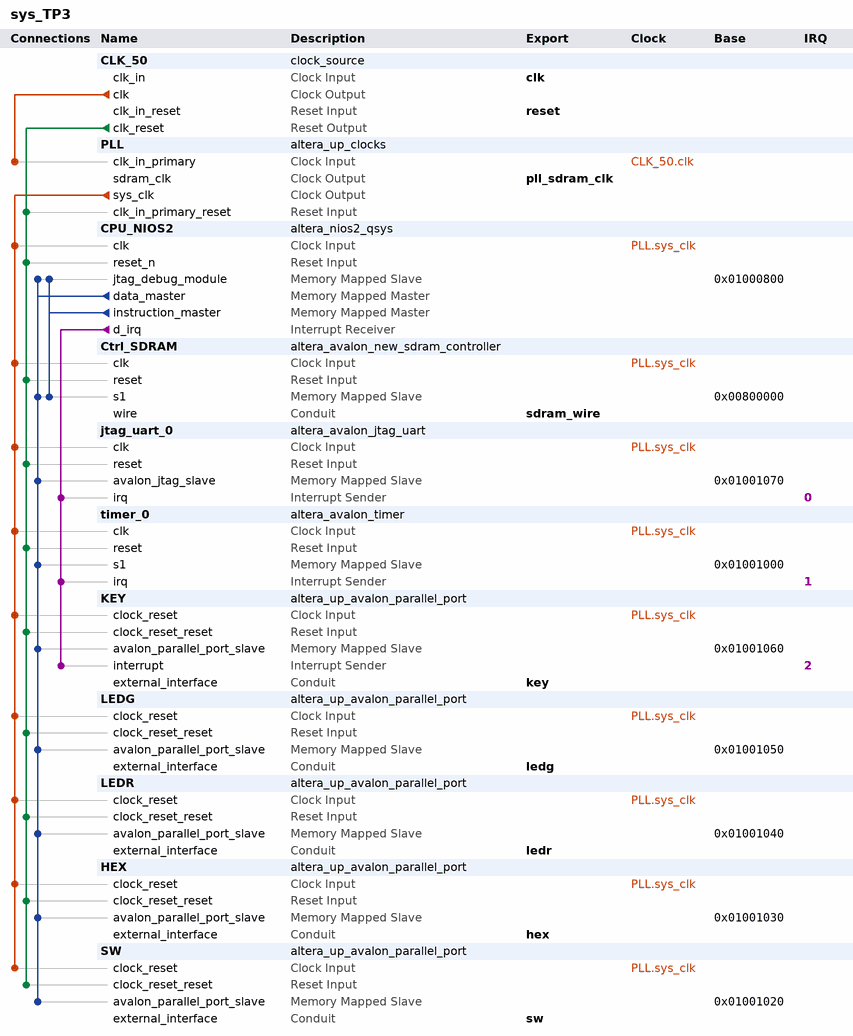
[diagram p0: system contents]
# Platform Designer (Qsys) system sys_TP3, Cyclone II EP2C20F484C7
# Parameters at their usual value, and those the tool derives, are not listed.
package require -exact qsys 13.0
create_system sys_TP3
set_project_property DEVICE_FAMILY {Cyclone II}
set_project_property DEVICE EP2C20F484C7

add_instance CLK_50 clock_source 13.0
set_instance_parameter_value CLK_50 clockFrequency 50000000

add_instance PLL altera_up_clocks 13.0
set_instance_parameter_value PLL board DE1
set_instance_parameter_value PLL vga_clk false
set_instance_parameter_value PLL audio_clk false
set_instance_parameter_value PLL audio_clk_freq 12.288

add_instance CPU_NIOS2 altera_nios2_qsys 13.0
set_instance_parameter_value CPU_NIOS2 resetSlave Ctrl_SDRAM.s1
set_instance_parameter_value CPU_NIOS2 mmu_TLBMissExcSlave None
set_instance_parameter_value CPU_NIOS2 exceptionSlave Ctrl_SDRAM.s1
set_instance_parameter_value CPU_NIOS2 breakSlave CPU_NIOS2.jtag_debug_module
set_instance_parameter_value CPU_NIOS2 impl Tiny
set_instance_parameter_value CPU_NIOS2 icache_size 4096

add_instance Ctrl_SDRAM altera_avalon_new_sdram_controller 13.0.1.99.2
set_instance_parameter_value Ctrl_SDRAM TAC 5.5
set_instance_parameter_value Ctrl_SDRAM TRCD 20.0
set_instance_parameter_value Ctrl_SDRAM TRP 20.0
set_instance_parameter_value Ctrl_SDRAM casLatency 3
set_instance_parameter_value Ctrl_SDRAM columnWidth 8
set_instance_parameter_value Ctrl_SDRAM dataWidth 16
set_instance_parameter_value Ctrl_SDRAM generateSimulationModel false
set_instance_parameter_value Ctrl_SDRAM model single_Micron_MT48LC4M32B2_7_chip
set_instance_parameter_value Ctrl_SDRAM numberOfBanks 4
set_instance_parameter_value Ctrl_SDRAM numberOfChipSelects 1
set_instance_parameter_value Ctrl_SDRAM powerUpDelay 100.0
set_instance_parameter_value Ctrl_SDRAM refreshPeriod 15.625
set_instance_parameter_value Ctrl_SDRAM rowWidth 12

add_instance jtag_uart_0 altera_avalon_jtag_uart 13.0.1.99.2
set_instance_parameter_value jtag_uart_0 simInteractiveOptions NO_INTERACTIVE_WINDOWS

add_instance timer_0 altera_avalon_timer 13.0.1.99.2
set_instance_parameter_value timer_0 period 1
set_instance_parameter_value timer_0 periodUnits SEC

add_instance KEY altera_up_avalon_parallel_port 13.0
set_instance_parameter_value KEY board DE1
set_instance_parameter_value KEY preset Pushbuttons
set_instance_parameter_value KEY capture true
set_instance_parameter_value KEY edge Rising
set_instance_parameter_value KEY irq true

add_instance LEDG altera_up_avalon_parallel_port 13.0
set_instance_parameter_value LEDG board DE1
set_instance_parameter_value LEDG preset LEDs
set_instance_parameter_value LEDG capture false
set_instance_parameter_value LEDG edge Rising
set_instance_parameter_value LEDG irq false

add_instance LEDR altera_up_avalon_parallel_port 13.0
set_instance_parameter_value LEDR board DE1
set_instance_parameter_value LEDR preset LEDs
set_instance_parameter_value LEDR leds Red
set_instance_parameter_value LEDR capture false
set_instance_parameter_value LEDR edge Rising
set_instance_parameter_value LEDR irq false

add_instance HEX altera_up_avalon_parallel_port 13.0
set_instance_parameter_value HEX board DE1
set_instance_parameter_value HEX preset {Seven Segment Displays}
set_instance_parameter_value HEX capture false
set_instance_parameter_value HEX edge Rising
set_instance_parameter_value HEX irq false

add_instance SW altera_up_avalon_parallel_port 13.0
set_instance_parameter_value SW board DE1
set_instance_parameter_value SW preset {Slider Switches}
set_instance_parameter_value SW capture false
set_instance_parameter_value SW edge Rising
set_instance_parameter_value SW irq false

# connections
add_connection CLK_50.clk PLL.clk_in_primary clock
add_connection PLL.sys_clk CPU_NIOS2.clk clock
add_connection PLL.sys_clk Ctrl_SDRAM.clk clock
add_connection PLL.sys_clk HEX.clock_reset clock
add_connection PLL.sys_clk jtag_uart_0.clk clock
add_connection PLL.sys_clk KEY.clock_reset clock
add_connection PLL.sys_clk LEDG.clock_reset clock
add_connection PLL.sys_clk LEDR.clock_reset clock
add_connection PLL.sys_clk SW.clock_reset clock
add_connection PLL.sys_clk timer_0.clk clock
add_connection CLK_50.clk_reset CPU_NIOS2.reset_n reset
add_connection CLK_50.clk_reset Ctrl_SDRAM.reset reset
add_connection CLK_50.clk_reset HEX.clock_reset_reset reset
add_connection CLK_50.clk_reset jtag_uart_0.reset reset
add_connection CLK_50.clk_reset KEY.clock_reset_reset reset
add_connection CLK_50.clk_reset LEDG.clock_reset_reset reset
add_connection CLK_50.clk_reset LEDR.clock_reset_reset reset
add_connection CLK_50.clk_reset PLL.clk_in_primary_reset reset
add_connection CLK_50.clk_reset SW.clock_reset_reset reset
add_connection CLK_50.clk_reset timer_0.reset reset
add_connection CPU_NIOS2.data_master CPU_NIOS2.jtag_debug_module avalon
set_connection_parameter_value CPU_NIOS2.data_master/CPU_NIOS2.jtag_debug_module baseAddress 0x01000800
add_connection CPU_NIOS2.data_master Ctrl_SDRAM.s1 avalon
set_connection_parameter_value CPU_NIOS2.data_master/Ctrl_SDRAM.s1 baseAddress 0x00800000
add_connection CPU_NIOS2.data_master HEX.avalon_parallel_port_slave avalon
set_connection_parameter_value CPU_NIOS2.data_master/HEX.avalon_parallel_port_slave baseAddress 0x01001030
add_connection CPU_NIOS2.data_master jtag_uart_0.avalon_jtag_slave avalon
set_connection_parameter_value CPU_NIOS2.data_master/jtag_uart_0.avalon_jtag_slave baseAddress 0x01001070
add_connection CPU_NIOS2.data_master KEY.avalon_parallel_port_slave avalon
set_connection_parameter_value CPU_NIOS2.data_master/KEY.avalon_parallel_port_slave baseAddress 0x01001060
add_connection CPU_NIOS2.data_master LEDG.avalon_parallel_port_slave avalon
set_connection_parameter_value CPU_NIOS2.data_master/LEDG.avalon_parallel_port_slave baseAddress 0x01001050
add_connection CPU_NIOS2.data_master LEDR.avalon_parallel_port_slave avalon
set_connection_parameter_value CPU_NIOS2.data_master/LEDR.avalon_parallel_port_slave baseAddress 0x01001040
add_connection CPU_NIOS2.data_master SW.avalon_parallel_port_slave avalon
set_connection_parameter_value CPU_NIOS2.data_master/SW.avalon_parallel_port_slave baseAddress 0x01001020
add_connection CPU_NIOS2.data_master timer_0.s1 avalon
set_connection_parameter_value CPU_NIOS2.data_master/timer_0.s1 baseAddress 0x01001000
add_connection CPU_NIOS2.instruction_master CPU_NIOS2.jtag_debug_module avalon
set_connection_parameter_value CPU_NIOS2.instruction_master/CPU_NIOS2.jtag_debug_module baseAddress 0x01000800
add_connection CPU_NIOS2.instruction_master Ctrl_SDRAM.s1 avalon
set_connection_parameter_value CPU_NIOS2.instruction_master/Ctrl_SDRAM.s1 baseAddress 0x00800000
add_connection CPU_NIOS2.d_irq jtag_uart_0.irq interrupt
set_connection_parameter_value CPU_NIOS2.d_irq/jtag_uart_0.irq irqNumber 0
add_connection CPU_NIOS2.d_irq KEY.interrupt interrupt
set_connection_parameter_value CPU_NIOS2.d_irq/KEY.interrupt irqNumber 2
add_connection CPU_NIOS2.d_irq timer_0.irq interrupt
set_connection_parameter_value CPU_NIOS2.d_irq/timer_0.irq irqNumber 1

# exported interfaces
add_interface clk clock sink
set_interface_property clk EXPORT_OF CLK_50.clk_in
add_interface reset reset sink
set_interface_property reset EXPORT_OF CLK_50.clk_in_reset
add_interface pll_sdram_clk clock source
set_interface_property pll_sdram_clk EXPORT_OF PLL.sdram_clk
add_interface sdram_wire conduit end
set_interface_property sdram_wire EXPORT_OF Ctrl_SDRAM.wire
add_interface key conduit end
set_interface_property key EXPORT_OF KEY.external_interface
add_interface ledg conduit end
set_interface_property ledg EXPORT_OF LEDG.external_interface
add_interface ledr conduit end
set_interface_property ledr EXPORT_OF LEDR.external_interface
add_interface hex conduit end
set_interface_property hex EXPORT_OF HEX.external_interface
add_interface sw conduit end
set_interface_property sw EXPORT_OF SW.external_interface

set_interconnect_requirement {$system} qsys_mm.clockCrossingAdapter HANDSHAKE
set_interconnect_requirement {$system} qsys_mm.maxAdditionalLatency 1

save_system sys_TP3.qsys
